# Altium schematic sheet stop_sign.SchDoc
size A4; SheetNumber: 1; SheetTotal: 2
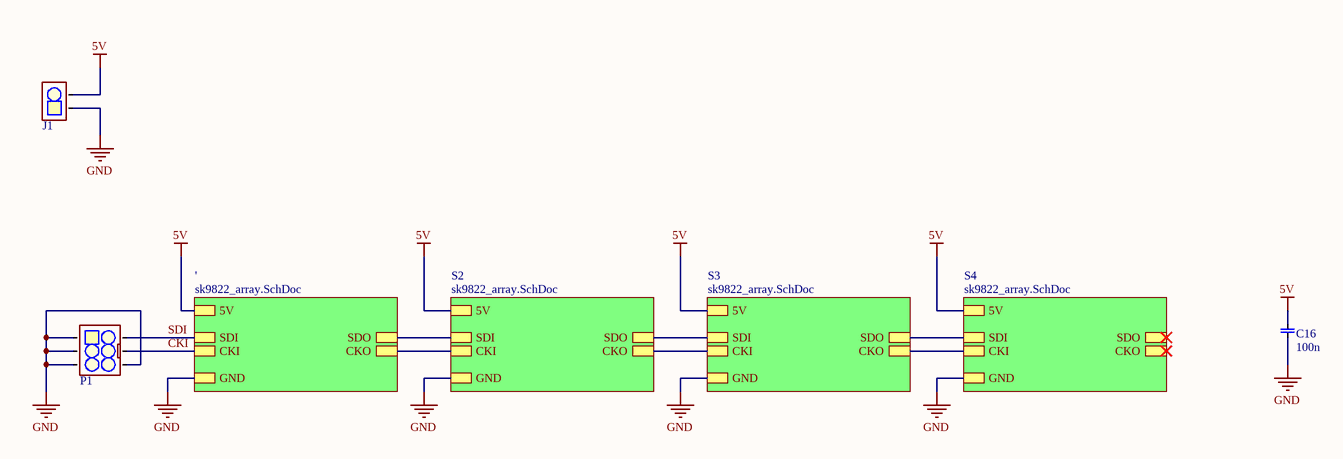
[diagram p0: stop_sign.SchDoc]

## Parts
C16  value 100n  [0603 cap]  (hidden comment: 0603, capacitor)
J1  2 Pole MSTBA Connector  [2POLE_MSTBA]  (value not drawn)
P1  2x3 Pin Header  [2x3 PH]  (value not drawn)

## Sub-sheets
' = sk9822_array.SchDoc: 5V, GND, SDI, CKI, SDO, CKO
S2 = sk9822_array.SchDoc: 5V, GND, SDI, CKI, SDO, CKO
S3 = sk9822_array.SchDoc: 5V, GND, SDI, CKI, SDO, CKO
S4 = sk9822_array.SchDoc: 5V, GND, SDI, CKI, SDO, CKO

## Nets
5V: C16.1 J1.2 ; sheet '/5V, sheet S2/5V, sheet S3/5V, sheet S4/5V
GND: C16.0 J1.1 P1.1 P1.2 P1.3 P1.4 ; sheet '/GND, sheet S2/GND, sheet S3/GND, sheet S4/GND
CKI: P1.5 ; sheet '/CKI
SDI: P1.6 ; sheet '/SDI
(unnamed): sheet '/SDO, sheet S2/SDI
(unnamed): sheet '/CKO, sheet S2/CKI
(unnamed): sheet S2/SDO, sheet S3/SDI
(unnamed): sheet S2/CKO, sheet S3/CKI
(unnamed): sheet S3/SDO, sheet S4/SDI
(unnamed): sheet S3/CKO, sheet S4/CKI

## Library data of the parts
P1 = 2x3 Ribbon connector: Value: 2x3 Pin Header, 2.54mm
C16 = 0603, capacitor: Order number: *